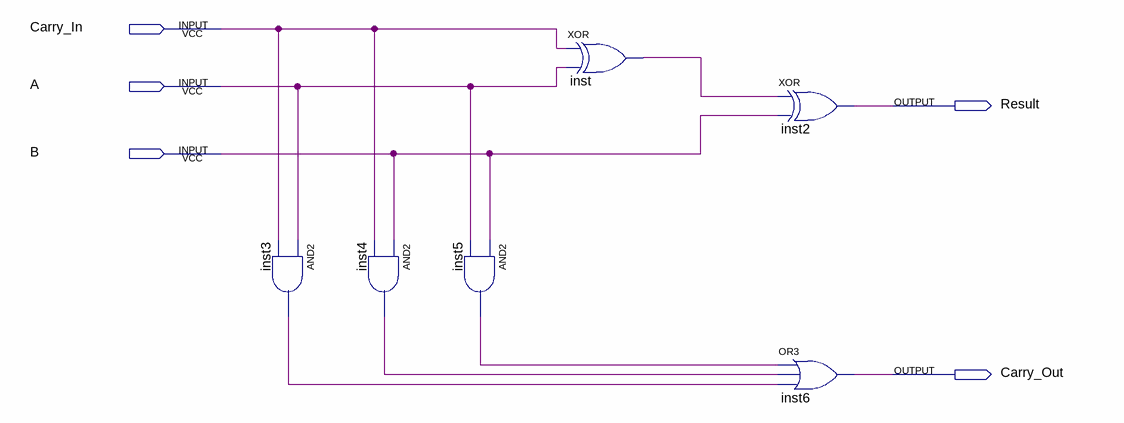
[diagram p0: schematic sheet]
// Quartus schematic SumBitBit.bdf as structural Verilog: 6 symbols, 5 pins
module SumBitBit (
  input  Carry_In,
  input  A,
  input  B,
  output Result,
  output Carry_Out
);

  wire inst3_out, inst4_out, inst5_out, inst_out;

  and inst3 (inst3_out, A, Carry_In);
  and inst4 (inst4_out, B, Carry_In);
  and inst5 (inst5_out, B, A);
  xor inst (inst_out, Carry_In, A);
  xor inst2 (Result, inst_out, B);
  or inst6 (Carry_Out, inst5_out, inst4_out, inst3_out);
endmodule
